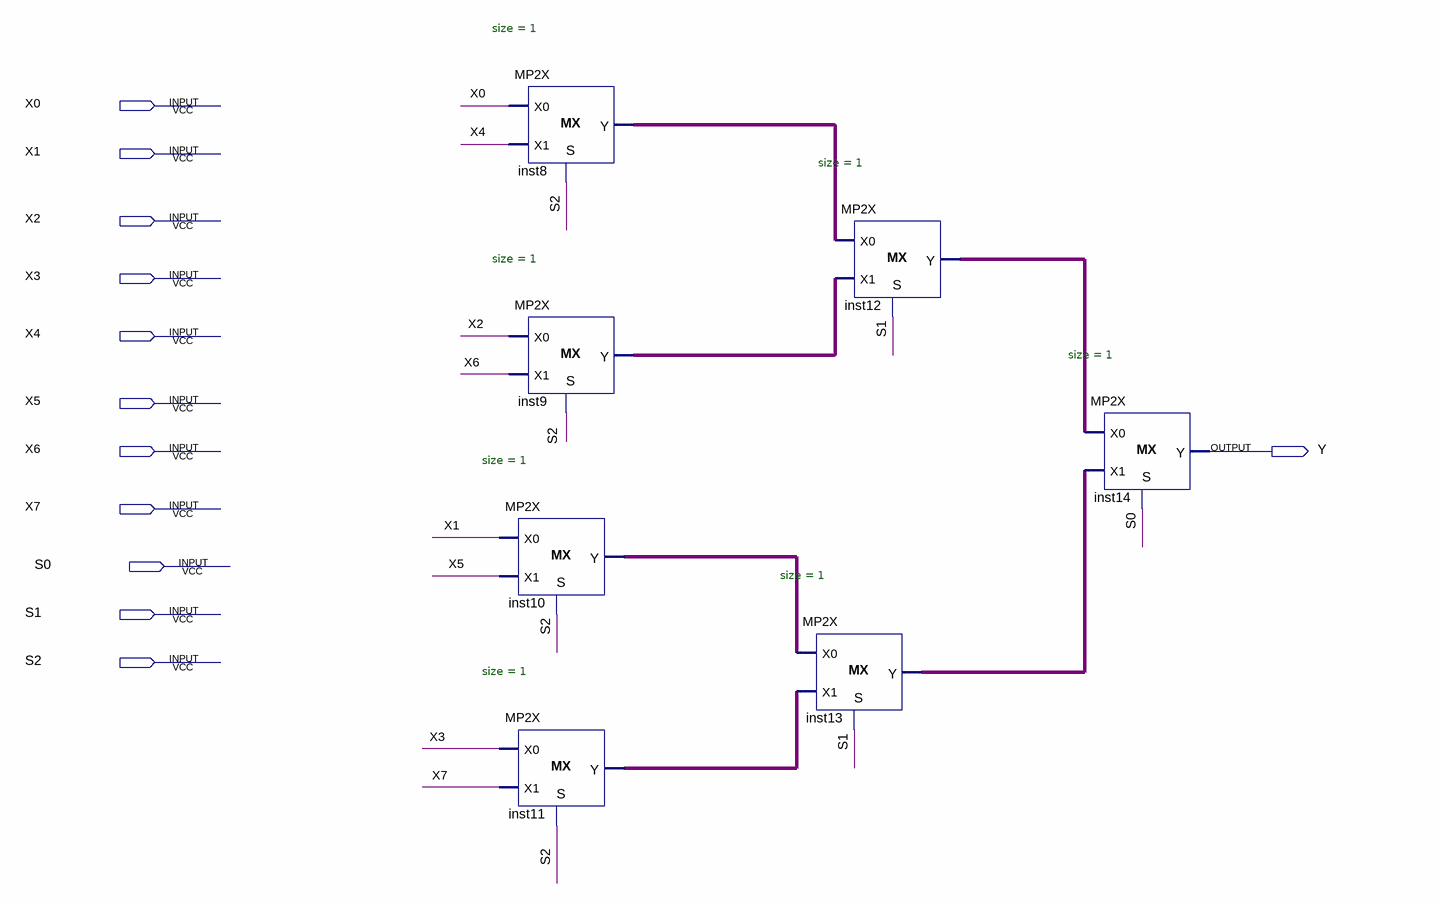
[diagram p0: schematic sheet]
// Quartus schematic MP8.bdf as structural Verilog: 7 symbols, 12 pins
module MP8 (
  input  X0,
  input  X1,
  input  X2,
  input  X3,
  input  X4,
  input  X5,
  input  X6,
  input  X7,
  input  S0,
  input  S1,
  input  S2,
  output Y
);

  wire inst8_y, inst9_y, inst10_y, inst11_y, inst12_y, inst13_y;

  MP2X #(.size(1)) inst10 (.S(S2), .X0(X1), .X1(X5), .Y(inst10_y));
  MP2X #(.size(1)) inst11 (.S(S2), .X0(X3), .X1(X7), .Y(inst11_y));
  MP2X #(.size(1)) inst8 (.S(S2), .X0(X0), .X1(X4), .Y(inst8_y));
  MP2X #(.size(1)) inst9 (.S(S2), .X0(X2), .X1(X6), .Y(inst9_y));
  MP2X #(.size(1)) inst13 (.S(S1), .X0(inst10_y), .X1(inst11_y), .Y(inst13_y));
  MP2X #(.size(1)) inst12 (.S(S1), .X0(inst8_y), .X1(inst9_y), .Y(inst12_y));
  MP2X #(.size(1)) inst14 (.S(S0), .X0(inst12_y), .X1(inst13_y), .Y(Y));
endmodule
